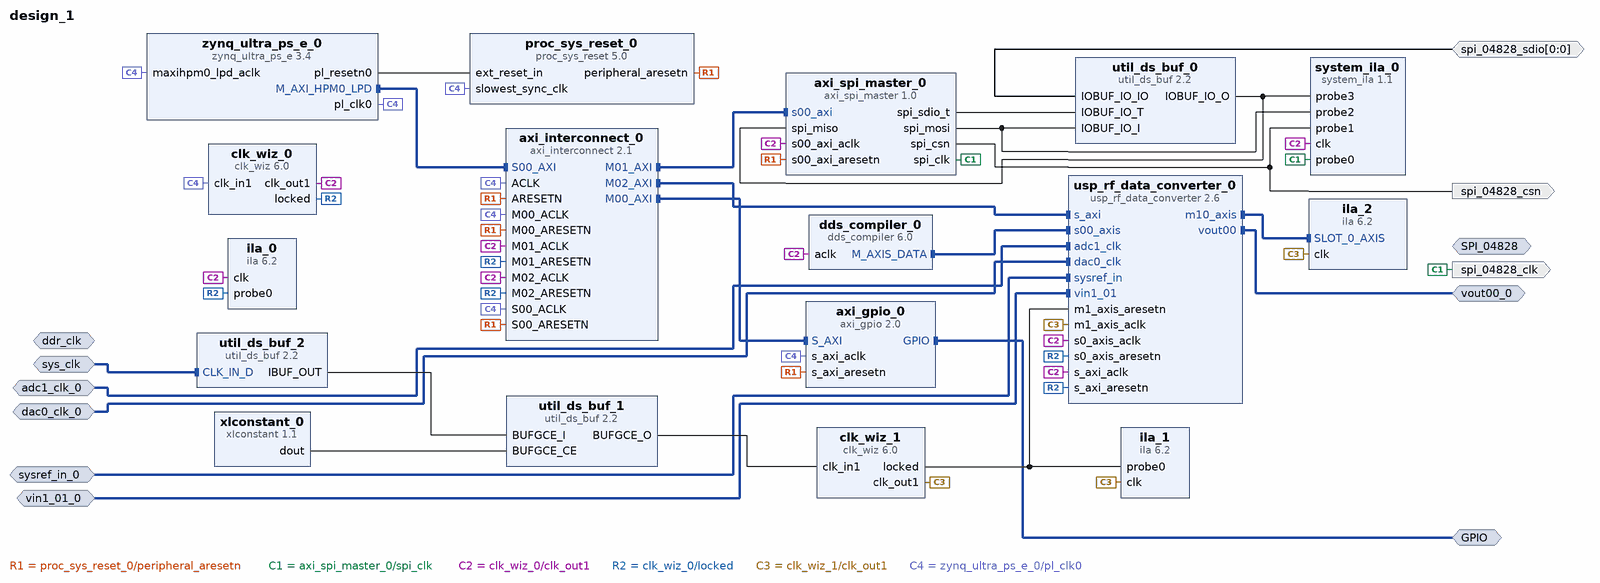
[diagram p0: block diagram of the top level]
# Vivado block design design_1, xczu27dr-fsve1156-2-i, Vivado 2022.2
create_bd_design design_1

create_bd_intf_port -mode Master -vlnv xilinx.com:interface:gpio_rtl:1.0 GPIO
create_bd_intf_port -mode Slave -vlnv xilinx.com:interface:diff_clock_rtl:1.0 ddr_clk
set_property -dict {CONFIG.FREQ_HZ 200000000} [get_bd_intf_ports ddr_clk]
create_bd_intf_port -mode Master -vlnv xilinx.com:interface:spi_rtl:1.0 SPI_04828
create_bd_intf_port -mode Slave -vlnv xilinx.com:interface:diff_clock_rtl:1.0 sys_clk
set_property -dict {CONFIG.FREQ_HZ 245760000} [get_bd_intf_ports sys_clk]
create_bd_intf_port -mode Slave -vlnv xilinx.com:display_usp_rf_data_converter:diff_pins_rtl:1.0 sysref_in_0
create_bd_intf_port -mode Slave -vlnv xilinx.com:interface:diff_clock_rtl:1.0 adc1_clk_0
create_bd_intf_port -mode Slave -vlnv xilinx.com:interface:diff_analog_io_rtl:1.0 vin1_01_0
create_bd_intf_port -mode Master -vlnv xilinx.com:interface:diff_analog_io_rtl:1.0 vout00_0
create_bd_intf_port -mode Slave -vlnv xilinx.com:interface:diff_clock_rtl:1.0 dac0_clk_0
create_bd_port -dir IO -from 0 -to 0 spi_04828_sdio
create_bd_port -dir O spi_04828_csn
create_bd_port -dir O -type clk spi_04828_clk

create_bd_cell -type ip -vlnv xilinx.com:ip:zynq_ultra_ps_e:3.4 zynq_ultra_ps_e_0
set_property -dict [list \
  CONFIG.PSU_BANK_0_IO_STANDARD LVCMOS18 \
  CONFIG.PSU_BANK_3_IO_STANDARD LVCMOS18 \
  CONFIG.PSU__CRF_APB__DDR_CTRL__FREQMHZ 1200 \
  CONFIG.PSU__CSUPMU__PERIPHERAL__VALID 1 \
  CONFIG.PSU__DDRC__DEVICE_CAPACITY {8192 MBits} \
  CONFIG.PSU__DDRC__DRAM_WIDTH {16 Bits} \
  CONFIG.PSU__DDRC__ECC Disabled \
  CONFIG.PSU__DDRC__SPEED_BIN DDR4_2400P \
  CONFIG.PSU__DDR_HIGH_ADDRESS_GUI_ENABLE 1 \
  CONFIG.PSU__DDR__INTERFACE__FREQMHZ 600.000 \
  CONFIG.PSU__DLL__ISUSED 1 \
  CONFIG.PSU__ENET3__FIFO__ENABLE 0 \
  CONFIG.PSU__ENET3__GRP_MDIO__ENABLE 1 \
  CONFIG.PSU__ENET3__GRP_MDIO__IO {MIO 76 .. 77} \
  CONFIG.PSU__ENET3__PERIPHERAL__ENABLE 1 \
  CONFIG.PSU__ENET3__PERIPHERAL__IO {MIO 64 .. 75} \
  CONFIG.PSU__ENET3__PTP__ENABLE 0 \
  CONFIG.PSU__ENET3__TSU__ENABLE 0 \
  CONFIG.PSU__GEM3_COHERENCY 0 \
  CONFIG.PSU__GEM3_ROUTE_THROUGH_FPD 0 \
  CONFIG.PSU__GEM__TSU__ENABLE 0 \
  CONFIG.PSU__GPIO_EMIO_WIDTH 4 \
  CONFIG.PSU__GPIO_EMIO__PERIPHERAL__ENABLE 1 \
  CONFIG.PSU__GPIO_EMIO__PERIPHERAL__IO 4 \
  CONFIG.PSU__I2C0__PERIPHERAL__ENABLE 0 \
  CONFIG.PSU__I2C1__PERIPHERAL__ENABLE 1 \
  CONFIG.PSU__I2C1__PERIPHERAL__IO {MIO 24 .. 25} \
  CONFIG.PSU__LPD_SLCR__CSUPMU__FREQMHZ 100 \
  CONFIG.PSU__PMU__PERIPHERAL__ENABLE 0 \
  CONFIG.PSU__QSPI_COHERENCY 0 \
  CONFIG.PSU__QSPI_ROUTE_THROUGH_FPD 0 \
  CONFIG.PSU__QSPI__GRP_FBCLK__ENABLE 0 \
  CONFIG.PSU__QSPI__PERIPHERAL__DATA_MODE x4 \
  CONFIG.PSU__QSPI__PERIPHERAL__ENABLE 1 \
  CONFIG.PSU__QSPI__PERIPHERAL__IO {MIO 0 .. 12} \
  CONFIG.PSU__QSPI__PERIPHERAL__MODE {Dual Parallel} \
  CONFIG.PSU__SD0__CLK_200_SDR_OTAP_DLY 0x3 \
  CONFIG.PSU__SD0__CLK_50_DDR_ITAP_DLY 0x12 \
  CONFIG.PSU__SD0__CLK_50_DDR_OTAP_DLY 0x6 \
  CONFIG.PSU__SD0__CLK_50_SDR_ITAP_DLY 0x15 \
  CONFIG.PSU__SD0__CLK_50_SDR_OTAP_DLY 0x6 \
  CONFIG.PSU__SD0__DATA_TRANSFER_MODE 8Bit \
  CONFIG.PSU__SD0__GRP_POW__ENABLE 1 \
  CONFIG.PSU__SD0__GRP_POW__IO {MIO 23} \
  CONFIG.PSU__SD0__PERIPHERAL__ENABLE 1 \
  CONFIG.PSU__SD0__PERIPHERAL__IO {MIO 13 .. 22} \
  CONFIG.PSU__SD0__RESET__ENABLE 1 \
  CONFIG.PSU__SD0__SLOT_TYPE eMMC \
  CONFIG.PSU__SD1_COHERENCY 0 \
  CONFIG.PSU__SD1_ROUTE_THROUGH_FPD 0 \
  CONFIG.PSU__SD1__CLK_50_SDR_ITAP_DLY 0x15 \
  CONFIG.PSU__SD1__CLK_50_SDR_OTAP_DLY 0x5 \
  CONFIG.PSU__SD1__DATA_TRANSFER_MODE 4Bit \
  CONFIG.PSU__SD1__GRP_CD__ENABLE 1 \
  CONFIG.PSU__SD1__GRP_CD__IO {MIO 45} \
  CONFIG.PSU__SD1__GRP_POW__ENABLE 0 \
  CONFIG.PSU__SD1__GRP_WP__ENABLE 0 \
  CONFIG.PSU__SD1__PERIPHERAL__ENABLE 1 \
  CONFIG.PSU__SD1__PERIPHERAL__IO {MIO 46 .. 51} \
  CONFIG.PSU__SD1__SLOT_TYPE {SD 2.0} \
  CONFIG.PSU__SWDT0__CLOCK__ENABLE 0 \
  CONFIG.PSU__SWDT0__PERIPHERAL__ENABLE 1 \
  CONFIG.PSU__SWDT0__RESET__ENABLE 0 \
  CONFIG.PSU__TSU__BUFG_PORT_PAIR 0 \
  CONFIG.PSU__TTC0__CLOCK__ENABLE 0 \
  CONFIG.PSU__TTC0__PERIPHERAL__ENABLE 1 \
  CONFIG.PSU__TTC0__WAVEOUT__ENABLE 0 \
  CONFIG.PSU__UART0__BAUD_RATE 115200 \
  CONFIG.PSU__UART0__MODEM__ENABLE 0 \
  CONFIG.PSU__UART0__PERIPHERAL__ENABLE 1 \
  CONFIG.PSU__UART0__PERIPHERAL__IO {MIO 38 .. 39} \
] [get_bd_cells zynq_ultra_ps_e_0]
# 61 more settings of zynq_ultra_ps_e_0 are not shown: defaults, MIO pin electricals, DDR timing, and values the tool derives
create_bd_cell -type ip -vlnv xilinx.com:ip:axi_interconnect:2.1 axi_interconnect_0
set_property -dict {CONFIG.NUM_MI 3} [get_bd_cells axi_interconnect_0]
create_bd_cell -type ip -vlnv xilinx.com:ip:axi_gpio:2.0 axi_gpio_0
set_property -dict {CONFIG.C_ALL_OUTPUTS 1 CONFIG.C_GPIO_WIDTH 1} [get_bd_cells axi_gpio_0]
create_bd_cell -type ip -vlnv xilinx.com:ip:proc_sys_reset:5.0 proc_sys_reset_0
create_bd_cell -type ip -vlnv xilinx.com:ip:util_ds_buf:2.2 util_ds_buf_0
set_property -dict {CONFIG.C_BUF_TYPE IOBUF} [get_bd_cells util_ds_buf_0]
create_bd_cell -type ip -vlnv vrhacker.com:user:axi_spi_master:1.0 axi_spi_master_0
create_bd_cell -type ip -vlnv xilinx.com:ip:clk_wiz:6.0 clk_wiz_0
set_property -dict [list \
  CONFIG.AUTO_PRIMITIVE PLL \
  CONFIG.CLKIN1_JITTER_PS 100.0 \
  CONFIG.CLKOUT1_DRIVES Buffer \
  CONFIG.CLKOUT1_JITTER 144.720 \
  CONFIG.CLKOUT1_PHASE_ERROR 114.213 \
  CONFIG.CLKOUT2_DRIVES Buffer \
  CONFIG.CLKOUT3_DRIVES Buffer \
  CONFIG.CLKOUT4_DRIVES Buffer \
  CONFIG.CLKOUT5_DRIVES Buffer \
  CONFIG.CLKOUT6_DRIVES Buffer \
  CONFIG.CLKOUT7_DRIVES Buffer \
  CONFIG.FEEDBACK_SOURCE FDBK_AUTO \
  CONFIG.MMCM_BANDWIDTH OPTIMIZED \
  CONFIG.MMCM_CLKFBOUT_MULT_F 8 \
  CONFIG.MMCM_CLKIN1_PERIOD 10.000 \
  CONFIG.MMCM_CLKIN2_PERIOD 10.000 \
  CONFIG.MMCM_CLKOUT0_DIVIDE_F 8 \
  CONFIG.MMCM_COMPENSATION AUTO \
  CONFIG.OPTIMIZE_CLOCKING_STRUCTURE_EN true \
  CONFIG.PRIMITIVE Auto \
  CONFIG.PRIM_IN_FREQ 99.999001 \
  CONFIG.PRIM_SOURCE Single_ended_clock_capable_pin \
  CONFIG.USE_LOCKED true \
  CONFIG.USE_RESET false \
] [get_bd_cells clk_wiz_0]
create_bd_cell -type ip -vlnv xilinx.com:ip:ila:6.2 ila_0
set_property -dict {CONFIG.C_MONITOR_TYPE Native} [get_bd_cells ila_0]
create_bd_cell -type ip -vlnv xilinx.com:ip:system_ila:1.1 system_ila_0
set_property -dict [list \
  CONFIG.C_DATA_DEPTH 8192 \
  CONFIG.C_MON_TYPE NATIVE \
  CONFIG.C_NUM_OF_PROBES 4 \
  CONFIG.C_PROBE0_TYPE 0 \
  CONFIG.C_PROBE1_TYPE 0 \
  CONFIG.C_PROBE2_TYPE 0 \
  CONFIG.C_PROBE3_TYPE 0 \
] [get_bd_cells system_ila_0]
create_bd_cell -type ip -vlnv xilinx.com:ip:usp_rf_data_converter:2.6 usp_rf_data_converter_0
set_property -dict [list \
  CONFIG.ADC1_Outclk_Freq 122.880 \
  CONFIG.ADC1_PLL_Enable true \
  CONFIG.ADC1_Refclk_Freq 245.760 \
  CONFIG.ADC1_Sampling_Rate 1.96608 \
  CONFIG.ADC_Data_Type10 0 \
  CONFIG.ADC_Data_Width10 1 \
  CONFIG.ADC_Decimation_Mode10 8 \
  CONFIG.ADC_Mixer_Mode10 2 \
  CONFIG.ADC_Mixer_Type10 0 \
  CONFIG.ADC_Slice00_Enable false \
  CONFIG.ADC_Slice10_Enable true \
  CONFIG.ADC_Slice12_Enable false \
  CONFIG.DAC0_Outclk_Freq 245.760 \
  CONFIG.DAC0_PLL_Enable true \
  CONFIG.DAC0_Refclk_Freq 245.760 \
  CONFIG.DAC0_Sampling_Rate 1.96608 \
  CONFIG.DAC_Data_Width00 1 \
  CONFIG.DAC_Interpolation_Mode00 8 \
  CONFIG.DAC_Mixer_Type00 0 \
  CONFIG.DAC_Slice00_Enable true \
  CONFIG.RF_Analyzer 0 \
] [get_bd_cells usp_rf_data_converter_0]
create_bd_cell -type ip -vlnv xilinx.com:ip:clk_wiz:6.0 clk_wiz_1
set_property -dict [list \
  CONFIG.CLKIN1_JITTER_PS 40.69 \
  CONFIG.CLKOUT1_JITTER 85.228 \
  CONFIG.CLKOUT1_PHASE_ERROR 77.902 \
  CONFIG.CLKOUT1_REQUESTED_OUT_FREQ 245.76 \
  CONFIG.CLKOUT2_JITTER 80.397 \
  CONFIG.CLKOUT2_PHASE_ERROR 73.358 \
  CONFIG.CLKOUT2_REQUESTED_OUT_FREQ 100.000 \
  CONFIG.CLKOUT2_USED false \
  CONFIG.MMCM_CLKFBOUT_MULT_F 4.875 \
  CONFIG.MMCM_CLKIN1_PERIOD 4.069 \
  CONFIG.MMCM_CLKIN2_PERIOD 10.0 \
  CONFIG.MMCM_CLKOUT0_DIVIDE_F 4.875 \
  CONFIG.MMCM_CLKOUT1_DIVIDE 1 \
  CONFIG.MMCM_DIVCLK_DIVIDE 1 \
  CONFIG.NUM_OUT_CLKS 1 \
  CONFIG.PRIM_IN_FREQ 245.76 \
  CONFIG.PRIM_SOURCE Global_buffer \
  CONFIG.USE_RESET false \
] [get_bd_cells clk_wiz_1]
create_bd_cell -type ip -vlnv xilinx.com:ip:ila:6.2 ila_1
set_property -dict [list \
  CONFIG.ALL_PROBE_SAME_MU_CNT 1 \
  CONFIG.C_MONITOR_TYPE Native \
  CONFIG.C_SLOT_0_AXI_PROTOCOL AXI4S \
] [get_bd_cells ila_1]
create_bd_cell -type ip -vlnv xilinx.com:ip:util_ds_buf:2.2 util_ds_buf_1
set_property -dict {CONFIG.C_BUF_TYPE BUFGCE} [get_bd_cells util_ds_buf_1]
create_bd_cell -type ip -vlnv xilinx.com:ip:util_ds_buf:2.2 util_ds_buf_2
create_bd_cell -type ip -vlnv xilinx.com:ip:xlconstant:1.1 xlconstant_0
create_bd_cell -type ip -vlnv xilinx.com:ip:ila:6.2 ila_2
set_property -dict {CONFIG.C_DATA_DEPTH 8192 CONFIG.C_SLOT_0_AXI_PROTOCOL AXI4S} [get_bd_cells ila_2]
create_bd_cell -type ip -vlnv xilinx.com:ip:dds_compiler:6.0 dds_compiler_0
set_property -dict [list \
  CONFIG.DDS_Clock_Rate 254.76 \
  CONFIG.Frequency_Resolution 0.1 \
  CONFIG.Latency 8 \
  CONFIG.Noise_Shaping Auto \
  CONFIG.Output_Frequency1 30 \
  CONFIG.Output_Selection Sine \
  CONFIG.Output_Width 14 \
  CONFIG.PINC1 11110001001010110000110001101 \
  CONFIG.Phase_Width 32 \
  CONFIG.Spurious_Free_Dynamic_Range 80 \
] [get_bd_cells dds_compiler_0]

# ---- connections ----

connect_bd_intf_net -intf_net adc1_clk_0_1 [get_bd_intf_ports adc1_clk_0] [get_bd_intf_pins usp_rf_data_converter_0/adc1_clk]
connect_bd_intf_net [get_bd_intf_ports GPIO] [get_bd_intf_pins axi_gpio_0/GPIO]
connect_bd_intf_net [get_bd_intf_pins axi_gpio_0/S_AXI] [get_bd_intf_pins axi_interconnect_0/M00_AXI]
connect_bd_intf_net [get_bd_intf_pins axi_interconnect_0/M01_AXI] [get_bd_intf_pins axi_spi_master_0/s00_axi]
connect_bd_intf_net [get_bd_intf_pins axi_interconnect_0/M02_AXI] [get_bd_intf_pins usp_rf_data_converter_0/s_axi]
connect_bd_intf_net -intf_net dac0_clk_0_1 [get_bd_intf_ports dac0_clk_0] [get_bd_intf_pins usp_rf_data_converter_0/dac0_clk]
connect_bd_intf_net [get_bd_intf_pins dds_compiler_0/M_AXIS_DATA] [get_bd_intf_pins usp_rf_data_converter_0/s00_axis]
connect_bd_intf_net [get_bd_intf_ports sys_clk] [get_bd_intf_pins util_ds_buf_2/CLK_IN_D]
connect_bd_intf_net -intf_net sysref_in_0_1 [get_bd_intf_ports sysref_in_0] [get_bd_intf_pins usp_rf_data_converter_0/sysref_in]
connect_bd_intf_net [get_bd_intf_pins usp_rf_data_converter_0/m10_axis] [get_bd_intf_pins ila_2/SLOT_0_AXIS]
connect_bd_intf_net [get_bd_intf_ports vout00_0] [get_bd_intf_pins usp_rf_data_converter_0/vout00]
connect_bd_intf_net -intf_net vin1_01_0_1 [get_bd_intf_ports vin1_01_0] [get_bd_intf_pins usp_rf_data_converter_0/vin1_01]
connect_bd_intf_net [get_bd_intf_pins zynq_ultra_ps_e_0/M_AXI_HPM0_LPD] [get_bd_intf_pins axi_interconnect_0/S00_AXI]
connect_bd_net -net ARESETN_1 [get_bd_pins proc_sys_reset_0/peripheral_aresetn] \
  [get_bd_pins axi_interconnect_0/ARESETN] [get_bd_pins axi_interconnect_0/S00_ARESETN] \
  [get_bd_pins axi_interconnect_0/M00_ARESETN] [get_bd_pins axi_gpio_0/s_axi_aresetn] \
  [get_bd_pins axi_spi_master_0/s00_axi_aresetn]
connect_bd_net [get_bd_ports spi_04828_sdio] [get_bd_pins util_ds_buf_0/IOBUF_IO_IO]
connect_bd_net -net axi_spi_master_0_spi_clk [get_bd_pins axi_spi_master_0/spi_clk] [get_bd_ports spi_04828_clk] [get_bd_pins system_ila_0/probe0]
connect_bd_net -net axi_spi_master_0_spi_csn [get_bd_pins axi_spi_master_0/spi_csn] [get_bd_ports spi_04828_csn] [get_bd_pins system_ila_0/probe1]
connect_bd_net -net axi_spi_master_0_spi_mosi [get_bd_pins axi_spi_master_0/spi_mosi] \
  [get_bd_pins util_ds_buf_0/IOBUF_IO_I] [get_bd_pins system_ila_0/probe2]
connect_bd_net [get_bd_pins axi_spi_master_0/spi_sdio_t] [get_bd_pins util_ds_buf_0/IOBUF_IO_T]
connect_bd_net [get_bd_pins clk_wiz_0/clk_out1] \
  [get_bd_pins axi_spi_master_0/s00_axi_aclk] [get_bd_pins axi_interconnect_0/M01_ACLK] [get_bd_pins ila_0/clk] \
  [get_bd_pins system_ila_0/clk] [get_bd_pins usp_rf_data_converter_0/s_axi_aclk] [get_bd_pins axi_interconnect_0/M02_ACLK] \
  [get_bd_pins usp_rf_data_converter_0/s0_axis_aclk] [get_bd_pins dds_compiler_0/aclk]
connect_bd_net [get_bd_pins clk_wiz_0/locked] \
  [get_bd_pins axi_interconnect_0/M01_ARESETN] [get_bd_pins ila_0/probe0] [get_bd_pins usp_rf_data_converter_0/s_axi_aresetn] \
  [get_bd_pins axi_interconnect_0/M02_ARESETN] [get_bd_pins usp_rf_data_converter_0/s0_axis_aresetn]
connect_bd_net [get_bd_pins clk_wiz_1/clk_out1] [get_bd_pins ila_1/clk] [get_bd_pins ila_2/clk] [get_bd_pins usp_rf_data_converter_0/m1_axis_aclk]
connect_bd_net [get_bd_pins clk_wiz_1/locked] [get_bd_pins ila_1/probe0] [get_bd_pins usp_rf_data_converter_0/m1_axis_aresetn]
connect_bd_net -net util_ds_buf_0_IOBUF_IO_O [get_bd_pins util_ds_buf_0/IOBUF_IO_O] \
  [get_bd_pins axi_spi_master_0/spi_miso] [get_bd_pins system_ila_0/probe3]
connect_bd_net [get_bd_pins util_ds_buf_1/BUFGCE_O] [get_bd_pins clk_wiz_1/clk_in1]
connect_bd_net [get_bd_pins util_ds_buf_2/IBUF_OUT] [get_bd_pins util_ds_buf_1/BUFGCE_I]
connect_bd_net [get_bd_pins xlconstant_0/dout] [get_bd_pins util_ds_buf_1/BUFGCE_CE]
connect_bd_net [get_bd_pins zynq_ultra_ps_e_0/pl_clk0] \
  [get_bd_pins zynq_ultra_ps_e_0/maxihpm0_lpd_aclk] [get_bd_pins axi_interconnect_0/ACLK] \
  [get_bd_pins axi_interconnect_0/S00_ACLK] [get_bd_pins axi_interconnect_0/M00_ACLK] [get_bd_pins axi_gpio_0/s_axi_aclk] \
  [get_bd_pins proc_sys_reset_0/slowest_sync_clk] [get_bd_pins clk_wiz_0/clk_in1]
connect_bd_net [get_bd_pins zynq_ultra_ps_e_0/pl_resetn0] [get_bd_pins proc_sys_reset_0/ext_reset_in]
set_property HDL_ATTRIBUTE.DEBUG true [get_bd_nets axi_spi_master_0_spi_clk]
set_property HDL_ATTRIBUTE.MARK_DEBUG true [get_bd_nets axi_spi_master_0_spi_clk]
set_property HDL_ATTRIBUTE.DEBUG true [get_bd_nets axi_spi_master_0_spi_csn]
set_property HDL_ATTRIBUTE.MARK_DEBUG true [get_bd_nets axi_spi_master_0_spi_csn]
set_property HDL_ATTRIBUTE.DEBUG true [get_bd_nets axi_spi_master_0_spi_mosi]
set_property HDL_ATTRIBUTE.MARK_DEBUG true [get_bd_nets axi_spi_master_0_spi_mosi]
set_property HDL_ATTRIBUTE.DEBUG true [get_bd_nets util_ds_buf_0_IOBUF_IO_O]
set_property HDL_ATTRIBUTE.MARK_DEBUG true [get_bd_nets util_ds_buf_0_IOBUF_IO_O]

# ---- address map ----
assign_bd_address -offset 0x0080000000 -range 4K -target_address_space [get_bd_addr_spaces zynq_ultra_ps_e_0/Data] [get_bd_addr_segs axi_gpio_0/S_AXI/Reg]
assign_bd_address -offset 0x0080001000 -range 4K -target_address_space [get_bd_addr_spaces zynq_ultra_ps_e_0/Data] [get_bd_addr_segs axi_spi_master_0/s00_axi/reg0]
assign_bd_address -offset 0x0080040000 -range 256K -target_address_space [get_bd_addr_spaces zynq_ultra_ps_e_0/Data] [get_bd_addr_segs usp_rf_data_converter_0/s_axi/Reg]

validate_bd_design
save_bd_design
